# EAGLE design Voltage-Indicator (EAGLE 6.5.0)
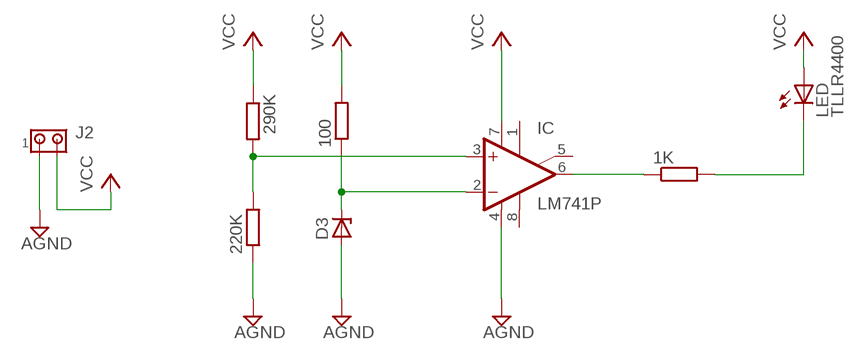
[diagram p0: schematic, sheet 1]

## Parts
1K  R-EU_0204/7  [0204/7]
100  R-EU_0204/7  [0204/7]
220K  R-EU_0204/7  [0204/7]
290K  R-EU_0204/7  [0204/7]
D3  ZENER-DIODEDO35Z10  [DO35Z10]
IC  LM741P  [DIL08]
J2  MTA02-100  [10X02MTA]
LED  TLLR4400  [LED3MM]

## Nets
GND: 220K.1 D3.A IC.4(V-) J2.1 ; supply symbol labelled AGND
IC: 1K.1 IC.6(OUT)
N$1: 1K.2 LED.K(C)
N$2: 100.1 D3.C IC.2(-IN)
N$3: 220K.2 290K.2 IC.3(+IN)
VCC: 100.2 290K.1 IC.7(V+) J2.2 LED.A
Unconnected: IC.1(ON1) IC.5(ON2) IC.8(OPT)

## Library data of the parts
1K 100 220K 290K = rcl:R-EU_: RESISTOR, European symbol
D3 = diode:ZENER-DIODE: Z-Diode
IC = linear:*741: OP AMP
J2 = con-amp:MTA02-100: AMP connector
LED = led:TLLR4400: Low Current (2mA) LED 3 mm Tinted Diffused Package color RED Source: Data sheet <http://www.farnell.com/datasheets/391100.pdf>; MF: VISHAY SEMICONDUCTOR; OC_FARNELL: 1612437

## Net classes
0 default: width 0.406 mm, clearance 0.508 mm

## Board
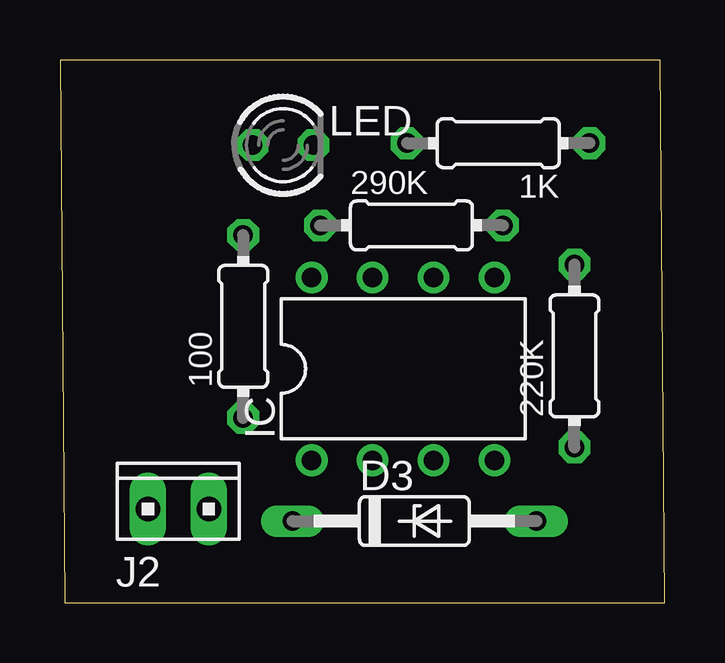
[diagram p1: board, top side]
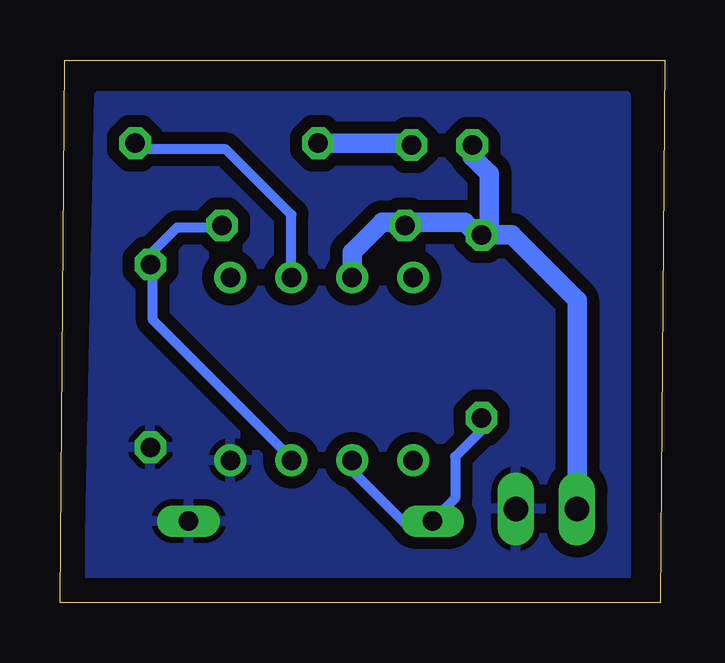
[diagram p2: board, bottom side, seen from below]

Size 25.2 x 22.62 mm. Coordinates in mm from the lower left corner, seen from the top.
Outline: 0.2,0 25.2,0 25,22.62 0,22.62 0.2,0
Copper layers (1*16): Top 0.035mm / dielectric 1.5mm / Bottom 0.035mm
Design rules "default": minimum track width 10mil, minimum drill 24mil, track to track 8mil, track to pad 8mil, pad to pad 8mil, via to via 8mil, smd to smd 8mil, copper to edge 40mil, drill to drill 8mil, minimum pad ring 10mil, minimum via ring 8mil, stop-mask expansion 4mil, vias tented up to drill 0mil, thermal gap 10mil

### Footprints (pad centres in the part's own frame; a part is rotated, then mirrored left to right if it is on the bottom)
0204/7 = drill 0.813 octagon: 1 -3.81,0; 2 3.81,0
DO35Z10 = drill 0.813 long: A 5.08,0; C -5.08,0
DIL08 = drill 0.813 pad 1.27: 1 -3.81,-3.81; 2 -1.27,-3.81; 3 1.27,-3.81; 4 3.81,-3.81; 5 3.81,3.81; 6 1.27,3.81; 7 -1.27,3.81; 8 -3.81,3.81
10X02MTA = drill 1.016 long: 1 1.27,0; 2 -1.27,0
LED3MM = drill 0.813 octagon: A -1.27,0; K 1.27,0

### Placement (x,y rotation side)
1K  18.26,19.15 180 top
100  7.64,11.52 90 top
220K  21.44,10.29 90 top
290K  14.64,15.73 0 top
D3  14.76,3.41 0 top
IC  14.3,9.75 0 top
J2  4.93,3.91 0 top
LED  9.29,19.07 0 top

### Tracks (layer width: path | path; a pad name or v marks a point on that pad's centre or on a via)
GND
  pour Bottom: 23.57,21.13 1.63,21.13 1.63,1.02 23.98,1.02
IC
  Bottom 0.406: IC.6 15.57,16.18 18.29,18.9 21.81,18.9 1K.1
N$1
  Bottom 0.813: 1K.2 10.65,19.15 LED.K
N$2
  Bottom 0.406: IC.2 13.03,5.51 10.77,3.25 9.84,3.25 D3.C 8.74,4.35 8.74,6.1 7.64,7.2 100.1
N$3
  Bottom 0.406: 290K.2 18.54,15.65 20.32,15.65 21.44,14.53 220K.2 21.34,14 21.34,11.79 15.57,6.02 IC.3
VCC
  Bottom 0.813: IC.7 13.03,14.61 11.79,15.85 10.96,15.85 290K.1 10.71,15.85 8.33,15.85 7.81,15.33 100.2 | LED.A 8.02,18.59 7.32,17.88 7.32,15.65 100.2 | 100.2 6.39,15.33 3.66,12.6 J2.2